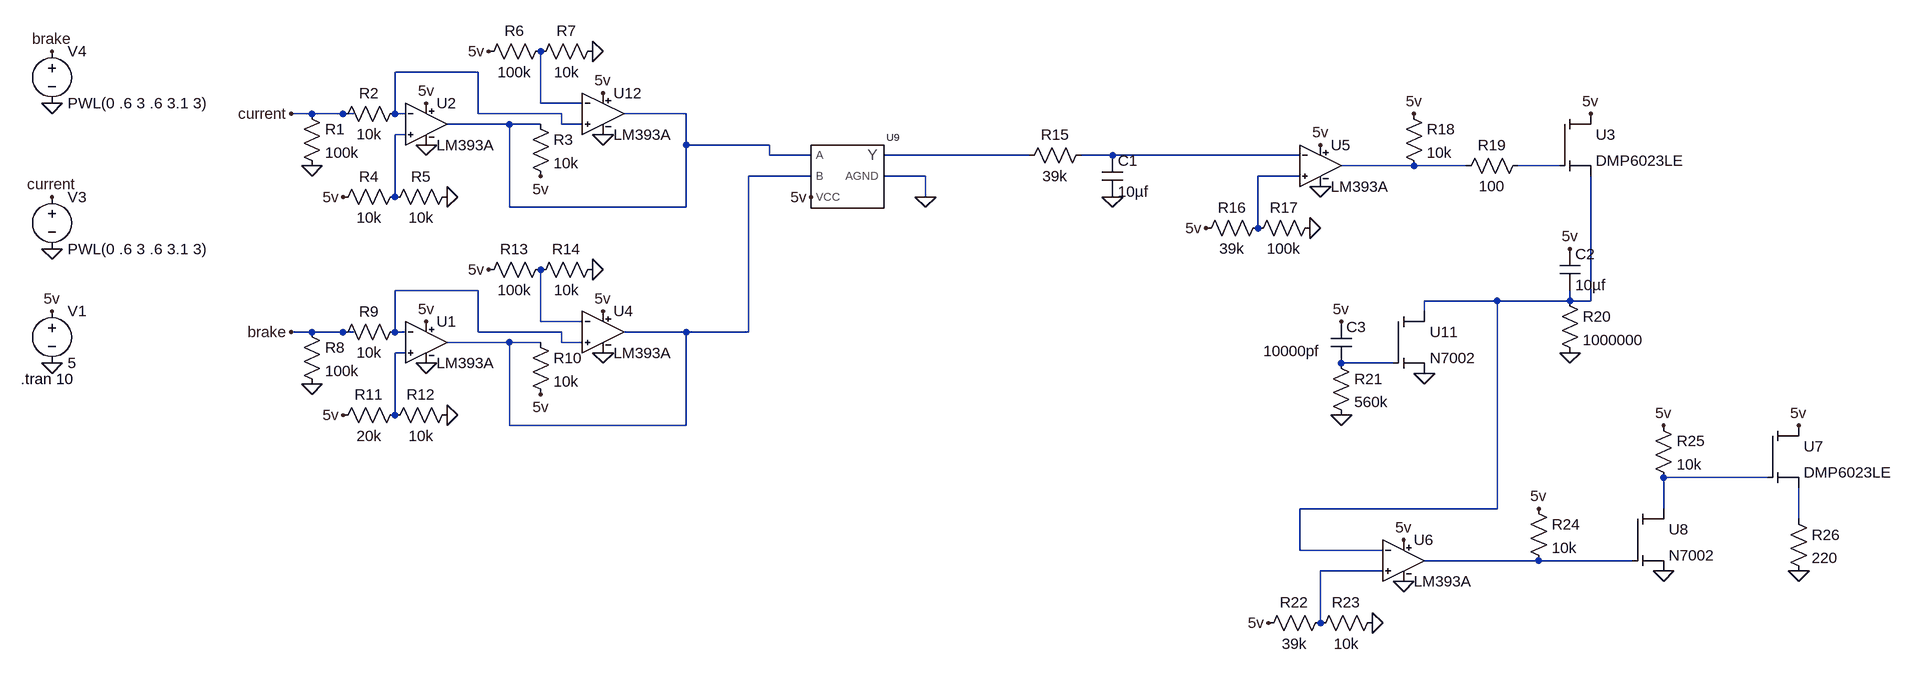
[diagram p0: schematic BSPD.asc]
BSPD.asc, the LTspice schematic file:
Version 4
SHEET 1 2808 684
WIRE 496 -224 368 -224
WIRE 592 -176 592 -256
WIRE 656 -176 592 -176
WIRE 240 -160 208 -160
WIRE 288 -160 240 -160
WIRE 304 -160 288 -160
WIRE 368 -160 368 -224
WIRE 384 -160 368 -160
WIRE 496 -160 496 -224
WIRE 624 -160 496 -160
WIRE 816 -160 720 -160
WIRE 544 -144 448 -144
WIRE 592 -144 544 -144
WIRE 624 -144 624 -160
WIRE 656 -144 624 -144
WIRE 384 -128 368 -128
WIRE 816 -112 816 -160
WIRE 944 -112 816 -112
WIRE 944 -96 944 -112
WIRE 1008 -96 944 -96
WIRE 1344 -96 1120 -96
WIRE 1472 -96 1424 -96
WIRE 1760 -96 1472 -96
WIRE 1936 -80 1824 -80
WIRE 2016 -80 1936 -80
WIRE 2160 -80 2096 -80
WIRE 1008 -64 912 -64
WIRE 1184 -64 1120 -64
WIRE 1760 -64 1696 -64
WIRE 368 -32 368 -128
WIRE 1184 -32 1184 -64
WIRE 544 -16 544 -144
WIRE 816 -16 816 -112
WIRE 816 -16 544 -16
WIRE 1696 16 1696 -64
WIRE 496 112 368 112
WIRE 2064 128 1952 128
WIRE 2176 128 2176 112
WIRE 2176 128 2064 128
WIRE 2208 128 2208 -64
WIRE 2208 128 2176 128
WIRE 1952 144 1952 128
WIRE 592 160 592 80
WIRE 656 160 592 160
WIRE 240 176 208 176
WIRE 288 176 240 176
WIRE 304 176 288 176
WIRE 368 176 368 112
WIRE 384 176 368 176
WIRE 496 176 496 112
WIRE 624 176 496 176
WIRE 816 176 720 176
WIRE 912 176 912 -64
WIRE 912 176 816 176
WIRE 544 192 448 192
WIRE 592 192 544 192
WIRE 624 192 624 176
WIRE 656 192 624 192
WIRE 384 208 368 208
WIRE 1904 224 1824 224
WIRE 368 304 368 208
WIRE 544 320 544 192
WIRE 816 320 816 176
WIRE 816 320 544 320
WIRE 2480 400 2320 400
WIRE 2064 448 2064 128
WIRE 2064 448 1760 448
WIRE 2320 448 2320 400
WIRE 2528 464 2528 416
WIRE 1760 512 1760 448
WIRE 1888 512 1760 512
WIRE 2128 528 1952 528
WIRE 2272 528 2128 528
WIRE 1888 544 1792 544
WIRE 1792 624 1792 544
FLAG -160 48 0
FLAG -160 224 0
FLAG -160 -176 0
FLAG -160 144 5v
FLAG -160 -32 current
FLAG -160 -256 brake
FLAG 416 -112 0
FLAG 416 -176 5v
FLAG 208 -160 current
FLAG 240 -80 0
FLAG 688 -128 0
FLAG 688 -192 5v
FLAG 448 -32 0
FLAG 288 -32 5v
FLAG 672 -256 0
FLAG 512 -256 5v
FLAG 592 -64 5v
FLAG 416 224 0
FLAG 416 160 5v
FLAG 240 256 0
FLAG 688 208 0
FLAG 688 144 5v
FLAG 448 304 0
FLAG 288 304 5v
FLAG 672 80 0
FLAG 512 80 5v
FLAG 592 272 5v
FLAG 208 176 brake
FLAG 1008 -32 5v
FLAG 1184 -32 0
FLAG 1472 -32 0
FLAG 1792 -112 5v
FLAG 1792 -48 0
FLAG 1616 16 5v
FLAG 1776 16 0
FLAG 1936 -160 5v
FLAG 2208 -160 5v
FLAG 2176 48 5v
FLAG 1952 240 0
FLAG 1824 160 5v
FLAG 1824 304 0
FLAG 1920 496 5v
FLAG 1872 624 0
FLAG 1712 624 5v
FLAG 1920 560 0
FLAG 2128 448 5v
FLAG 2176 208 0
FLAG 2320 544 0
FLAG 2320 320 5v
FLAG 2528 320 5v
FLAG 2528 544 0
SYMBOL voltage -160 128 R0
WINDOW 123 0 0 Left 0
WINDOW 39 0 0 Left 0
SYMATTR InstName V1
SYMATTR Value 5
SYMBOL voltage -160 -48 R0
WINDOW 123 0 0 Left 0
WINDOW 39 0 0 Left 0
SYMATTR InstName V3
SYMATTR Value PWL(0 .6 3 .6 3.1 3)
SYMBOL voltage -160 -272 R0
WINDOW 123 0 0 Left 0
WINDOW 39 0 0 Left 0
SYMATTR InstName V4
SYMATTR Value PWL(0 .6 3 .6 3.1 3)
SYMBOL res 224 -176 R0
SYMATTR InstName R1
SYMATTR Value 100k
SYMBOL res 384 -176 R90
WINDOW 0 0 56 VBottom 2
WINDOW 3 32 56 VTop 2
SYMATTR InstName R2
SYMATTR Value 10k
SYMBOL res 576 -160 R0
SYMATTR InstName R3
SYMATTR Value 10k
SYMBOL res 384 -48 R90
WINDOW 0 0 56 VBottom 2
WINDOW 3 32 56 VTop 2
SYMATTR InstName R4
SYMATTR Value 10k
SYMBOL res 464 -48 R90
WINDOW 0 0 56 VBottom 2
WINDOW 3 32 56 VTop 2
SYMATTR InstName R5
SYMATTR Value 10k
SYMBOL res 608 -272 R90
WINDOW 0 0 56 VBottom 2
WINDOW 3 32 56 VTop 2
SYMATTR InstName R6
SYMATTR Value 100k
SYMBOL res 688 -272 R90
WINDOW 0 0 56 VBottom 2
WINDOW 3 32 56 VTop 2
SYMATTR InstName R7
SYMATTR Value 10k
SYMBOL res 224 160 R0
SYMATTR InstName R8
SYMATTR Value 100k
SYMBOL res 384 160 R90
WINDOW 0 0 56 VBottom 2
WINDOW 3 32 56 VTop 2
SYMATTR InstName R9
SYMATTR Value 10k
SYMBOL res 576 176 R0
SYMATTR InstName R10
SYMATTR Value 10k
SYMBOL res 384 288 R90
WINDOW 0 0 56 VBottom 2
WINDOW 3 32 56 VTop 2
SYMATTR InstName R11
SYMATTR Value 20k
SYMBOL res 464 288 R90
WINDOW 0 0 56 VBottom 2
WINDOW 3 32 56 VTop 2
SYMATTR InstName R12
SYMATTR Value 10k
SYMBOL res 608 64 R90
WINDOW 0 0 56 VBottom 2
WINDOW 3 32 56 VTop 2
SYMATTR InstName R13
SYMATTR Value 100k
SYMBOL res 688 64 R90
WINDOW 0 0 56 VBottom 2
WINDOW 3 32 56 VTop 2
SYMATTR InstName R14
SYMATTR Value 10k
SYMBOL res 1440 -112 R90
WINDOW 0 0 56 VBottom 2
WINDOW 3 32 56 VTop 2
SYMATTR InstName R15
SYMATTR Value 39k
SYMBOL cap 1456 -96 R0
SYMATTR InstName C1
SYMATTR Value 10µf
SYMBOL res 1712 0 R90
WINDOW 0 0 56 VBottom 2
WINDOW 3 32 56 VTop 2
SYMATTR InstName R16
SYMATTR Value 39k
SYMBOL res 1792 0 R90
WINDOW 0 0 56 VBottom 2
WINDOW 3 32 56 VTop 2
SYMATTR InstName R17
SYMATTR Value 100k
SYMBOL res 1920 -176 R0
SYMATTR InstName R18
SYMATTR Value 10k
SYMBOL res 2112 -96 R90
WINDOW 0 0 56 VBottom 2
WINDOW 3 32 56 VTop 2
SYMATTR InstName R19
SYMATTR Value 100
SYMBOL cap 2160 48 R0
SYMATTR InstName C2
SYMATTR Value 10µf
SYMBOL res 2160 112 R0
SYMATTR InstName R20
SYMATTR Value 1000000
SYMBOL cap 1808 160 R0
WINDOW 3 -104 45 Left 2
SYMATTR Value 10000pf
SYMATTR InstName C3
SYMBOL res 1808 208 R0
SYMATTR InstName R21
SYMATTR Value 560k
SYMBOL res 1808 608 R90
WINDOW 0 0 56 VBottom 2
WINDOW 3 32 56 VTop 2
SYMATTR InstName R22
SYMATTR Value 39k
SYMBOL res 1888 608 R90
WINDOW 0 0 56 VBottom 2
WINDOW 3 32 56 VTop 2
SYMATTR InstName R23
SYMATTR Value 10k
SYMBOL res 2112 432 R0
SYMATTR InstName R24
SYMATTR Value 10k
SYMBOL res 2304 304 R0
SYMATTR InstName R25
SYMATTR Value 10k
SYMBOL res 2512 448 R0
SYMATTR InstName R26
SYMATTR Value 220
SYMBOL LM393 688 -224 R0
SYMATTR InstName U12
SYMBOL LM393 416 -208 R0
SYMATTR InstName U2
SYMBOL LM393 416 128 R0
SYMATTR InstName U1
SYMBOL LM393 688 112 R0
SYMATTR InstName U4
SYMBOL LM393 1792 -144 R0
SYMATTR InstName U5
SYMBOL LM393 1920 464 R0
SYMATTR InstName U6
SYMBOL SN74AHC1G02 1008 -112 R0
SYMATTR InstName U9
SYMBOL DMP6023LE 2160 -160 R0
SYMATTR InstName U3
SYMBOL DMP6023LE 2480 320 R0
SYMATTR InstName U7
SYMBOL 2N7002 1904 144 R0
SYMATTR InstName U11
SYMBOL 2N7002 2272 448 R0
SYMATTR InstName U8
TEXT -208 248 Left 2 !.tran 10

The netlist it stands for:
* BSPD.asc
V1 5v 0 5
V3 current 0 PWL(0 .6 3 .6 3.1 3)
V4 brake 0 PWL(0 .6 3 .6 3.1 3)
R1 current 0 100k
R2 N001 current 10k
R3 N003 5v 10k
R4 N004 5v 10k
R5 0 N004 10k
R6 N002 5v 100k
R7 0 N002 10k
R8 brake 0 100k
R9 N011 brake 10k
R10 N009 5v 10k
R11 N014 5v 20k
R12 0 N014 10k
R13 N013 5v 100k
R14 0 N013 10k
R15 N006 N005 39k
C1 N006 0 10µf
R16 N010 5v 39k
R17 0 N010 100k
R18 5v N007 10k
R19 N008 N007 100
C2 5v N012 10µf
R20 N012 0 1000000
C3 5v N015 10000pf
R21 N015 0 560k
R22 N019 5v 39k
R23 0 N019 10k
R24 5v N018 10k
R25 5v N016 10k
R26 N017 0 220
XU12 N001 N002 5v 0 N003 LM393A  ; pins In+ In- V+ V- OUT
XU2 N004 N001 5v 0 N003 LM393A  ; pins In+ In- V+ V- OUT
XU1 N014 N011 5v 0 N009 LM393A  ; pins In+ In- V+ V- OUT
XU4 N011 N013 5v 0 N009 LM393A  ; pins In+ In- V+ V- OUT
XU5 N010 N006 5v 0 N007 LM393A  ; pins In+ In- V+ V- OUT
XU6 N019 N012 5v 0 N018 LM393A  ; pins In+ In- V+ V- OUT
XU9 N005 N003 N009 5v 0 SN74AHC1G02  ; pins Y A B VCC AGND
XU3 N012 N008 5v DMP6023LE  ; pins D G S
XU7 N017 N016 5v DMP6023LE  ; pins D G S
XU11 N012 N015 0 N7002  ; pins D G S
XU8 N016 N018 0 N7002  ; pins D G S
.tran 10
.lib LM393.lib
.lib SN74AHC1G02.lib
.lib DMP6023LE.lib
.lib 2N7002.lib
.backanno
.end